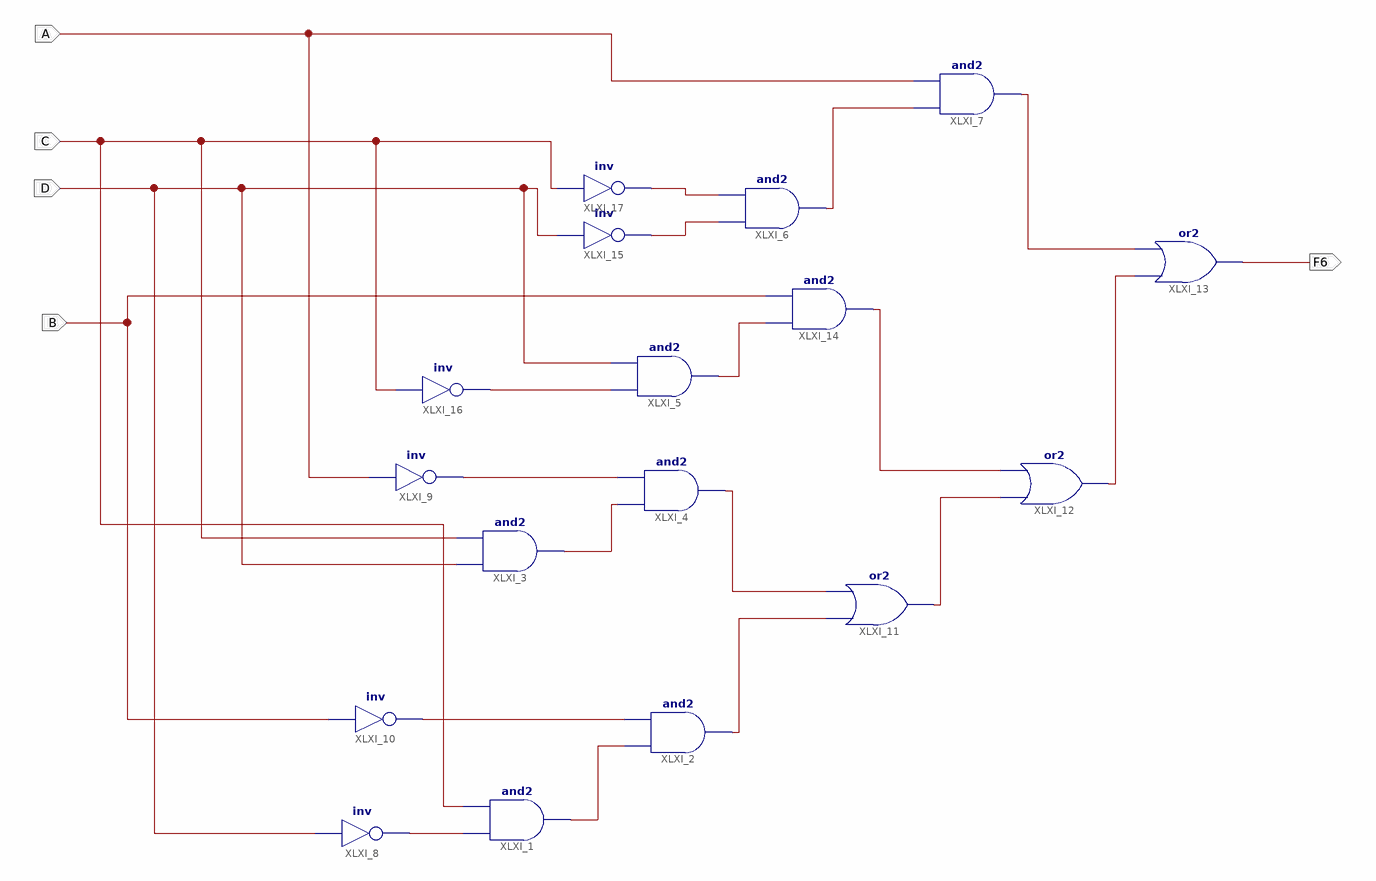
[diagram p0: schematic sheet 1]
// Xilinx ISE schematic F6.sch (artix7) as structural Verilog: 17 symbols, 5 ports
module F6 (
  input  B,
  input  C,
  input  D,
  input  A,
  output F6
);

  wire XLXN_1, XLXN_3, XLXN_6, XLXN_7, XLXN_8, XLXN_9, XLXN_11, XLXN_14, XLXN_15, XLXN_16, XLXN_17, XLXN_22,
       XLXN_23, XLXN_24, XLXN_25, XLXN_26;

  not XLXI_8 (XLXN_1, D);
  not XLXI_10 (XLXN_6, B);
  or XLXI_12 (XLXN_26, XLXN_17, XLXN_16);
  or XLXI_13 (F6, XLXN_26, XLXN_25);
  and XLXI_7 (XLXN_25, XLXN_24, A);
  and XLXI_6 (XLXN_24, XLXN_23, XLXN_22);
  not XLXI_15 (XLXN_23, D);
  not XLXI_17 (XLXN_22, C);
  and XLXI_14 (XLXN_16, XLXN_15, B);
  not XLXI_16 (XLXN_14, C);
  and XLXI_5 (XLXN_15, XLXN_14, D);
  and XLXI_1 (XLXN_3, XLXN_1, C);
  and XLXI_2 (XLXN_11, XLXN_3, XLXN_6);
  and XLXI_4 (XLXN_9, XLXN_8, XLXN_7);
  or XLXI_11 (XLXN_17, XLXN_11, XLXN_9);
  and XLXI_3 (XLXN_8, D, C);
  not XLXI_9 (XLXN_7, A);
endmodule
